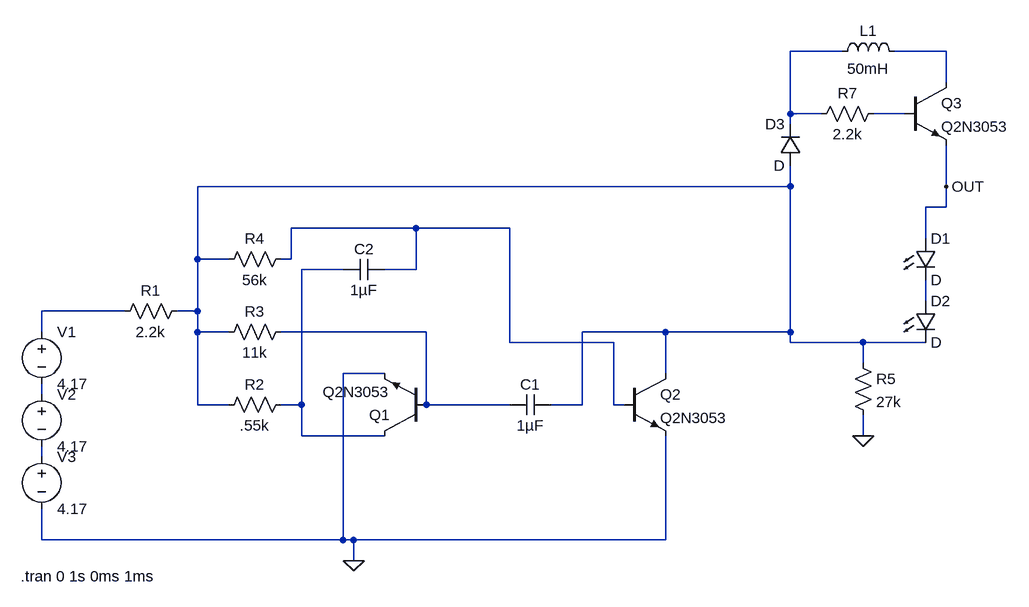
[diagram p0: schematic strobe.asc]
strobe.asc, the LTspice schematic file:
Version 4
SHEET 1 1692 680
WIRE 1360 -432 1280 -432
WIRE 1520 -432 1440 -432
WIRE 1520 -384 1520 -432
WIRE 1280 -336 1280 -432
WIRE 1328 -336 1280 -336
WIRE 1456 -336 1408 -336
WIRE 1280 -320 1280 -336
WIRE 1280 -224 1280 -256
WIRE 1280 -224 368 -224
WIRE 1520 -224 1520 -288
WIRE 1520 -192 1520 -224
WIRE 1520 -192 1488 -192
WIRE 704 -160 512 -160
WIRE 848 -160 704 -160
WIRE 1488 -144 1488 -192
WIRE 368 -112 368 -224
WIRE 416 -112 368 -112
WIRE 512 -112 512 -160
WIRE 512 -112 496 -112
WIRE 592 -96 528 -96
WIRE 704 -96 704 -160
WIRE 704 -96 656 -96
WIRE 1488 -48 1488 -80
WIRE 256 -32 128 -32
WIRE 368 -32 368 -112
WIRE 368 -32 336 -32
WIRE 128 0 128 -32
WIRE 368 0 368 -32
WIRE 416 0 368 0
WIRE 720 0 496 0
WIRE 1088 0 960 0
WIRE 1280 0 1280 -224
WIRE 1280 0 1088 0
WIRE 848 16 848 -160
WIRE 1008 16 848 16
WIRE 1280 16 1280 0
WIRE 1392 16 1280 16
WIRE 1488 16 1392 16
WIRE 1392 48 1392 16
WIRE 656 64 592 64
WIRE 1088 64 1088 0
WIRE 128 96 128 80
WIRE 368 112 368 0
WIRE 416 112 368 112
WIRE 528 112 528 -96
WIRE 528 112 496 112
WIRE 720 112 720 0
WIRE 848 112 720 112
WIRE 960 112 960 0
WIRE 960 112 912 112
WIRE 1008 112 1008 16
WIRE 1024 112 1008 112
WIRE 528 160 528 112
WIRE 656 160 528 160
WIRE 1392 160 1392 128
WIRE 128 192 128 176
WIRE 128 320 128 272
WIRE 592 320 592 64
WIRE 592 320 128 320
WIRE 608 320 592 320
WIRE 1088 320 1088 160
WIRE 1088 320 608 320
WIRE 608 352 608 320
FLAG 608 352 0
FLAG 1392 160 0
FLAG 1520 -224 OUT
SYMBOL voltage 128 -16 R0
WINDOW 123 0 0 Left 0
WINDOW 39 0 0 Left 0
SYMATTR InstName V1
SYMATTR Value 4.17
SYMBOL voltage 128 80 R0
WINDOW 123 0 0 Left 0
WINDOW 39 0 0 Left 0
SYMATTR InstName V2
SYMATTR Value 4.17
SYMBOL voltage 128 176 R0
WINDOW 123 0 0 Left 0
WINDOW 39 0 0 Left 0
SYMATTR InstName V3
SYMATTR Value 4.17
SYMBOL res 352 -48 R90
WINDOW 0 0 56 VBottom 2
WINDOW 3 32 56 VTop 2
SYMATTR InstName R1
SYMATTR Value 2.2k
SYMBOL res 512 96 R90
WINDOW 0 0 56 VBottom 2
WINDOW 3 32 56 VTop 2
SYMATTR InstName R2
SYMATTR Value .55k
SYMBOL res 512 -16 R90
WINDOW 0 0 56 VBottom 2
WINDOW 3 32 56 VTop 2
SYMATTR InstName R3
SYMATTR Value 11k
SYMBOL res 512 -128 R90
WINDOW 0 0 56 VBottom 2
WINDOW 3 32 56 VTop 2
SYMATTR InstName R4
SYMATTR Value 56k
SYMBOL npn 720 160 R180
SYMATTR InstName Q1
SYMATTR Value Q2N3053
SYMBOL npn 1024 64 R0
SYMATTR InstName Q2
SYMATTR Value Q2N3053
SYMBOL cap 912 96 R90
WINDOW 0 0 32 VBottom 2
WINDOW 3 32 32 VTop 2
SYMATTR InstName C1
SYMATTR Value 1µF
SYMATTR SpiceLine V=25v
SYMBOL cap 656 -112 R90
WINDOW 0 0 32 VBottom 2
WINDOW 3 32 32 VTop 2
SYMATTR InstName C2
SYMATTR Value 1µF
SYMATTR SpiceLine V=25v
SYMBOL LED 1472 -144 R0
SYMATTR InstName D1
SYMBOL LED 1472 -48 R0
SYMATTR InstName D2
SYMBOL res 1376 32 R0
SYMATTR InstName R5
SYMATTR Value 27k
SYMBOL npn 1456 -384 R0
SYMATTR InstName Q3
SYMATTR Value Q2N3053
SYMBOL res 1424 -352 R90
WINDOW 0 0 56 VBottom 2
WINDOW 3 32 56 VTop 2
SYMATTR InstName R7
SYMATTR Value 2.2k
SYMBOL diode 1296 -256 R180
WINDOW 0 24 64 Left 2
WINDOW 3 24 0 Left 2
SYMATTR InstName D3
SYMBOL ind 1344 -416 R270
WINDOW 0 32 56 VTop 2
WINDOW 3 5 56 VBottom 2
SYMATTR InstName L1
SYMATTR Value 50mH
TEXT 96 376 Left 2 !.tran 0 1s 0ms 1ms

The netlist it stands for:
* strobe.asc
V1 N008 N010 4.17
V2 N010 N011 4.17
V3 N011 0 4.17
R1 N004 N008 2.2k
R2 N006 N004 .55k
R3 N009 N004 11k
R4 N005 N004 56k
Q1 N006 N009 0 0 Q2N3053
Q2 N004 N005 0 0 Q2N3053
C1 N004 N009 1µF V=25v
C2 N005 N006 1µF V=25v
D1 OUT N007 D
D2 N007 N004 D
R5 N004 0 27k
Q3 N002 N003 OUT 0 Q2N3053
R7 N003 N001 2.2k
D3 N004 N001 D
L1 N001 N002 50mH
.model D D
.lib standard.dio
.model NPN NPN
.model PNP PNP
.lib standard.bjt
.tran 0 1s 0ms 1ms
.backanno
.end